# EasyEDA schematic 1-Schematic_SmartTracker.json
TITLE: SmartTracker; REV: 1.0; Date: 2023-10-11; Sheet: 1/1; Drawn By: eleminer; Company: SmartTracker
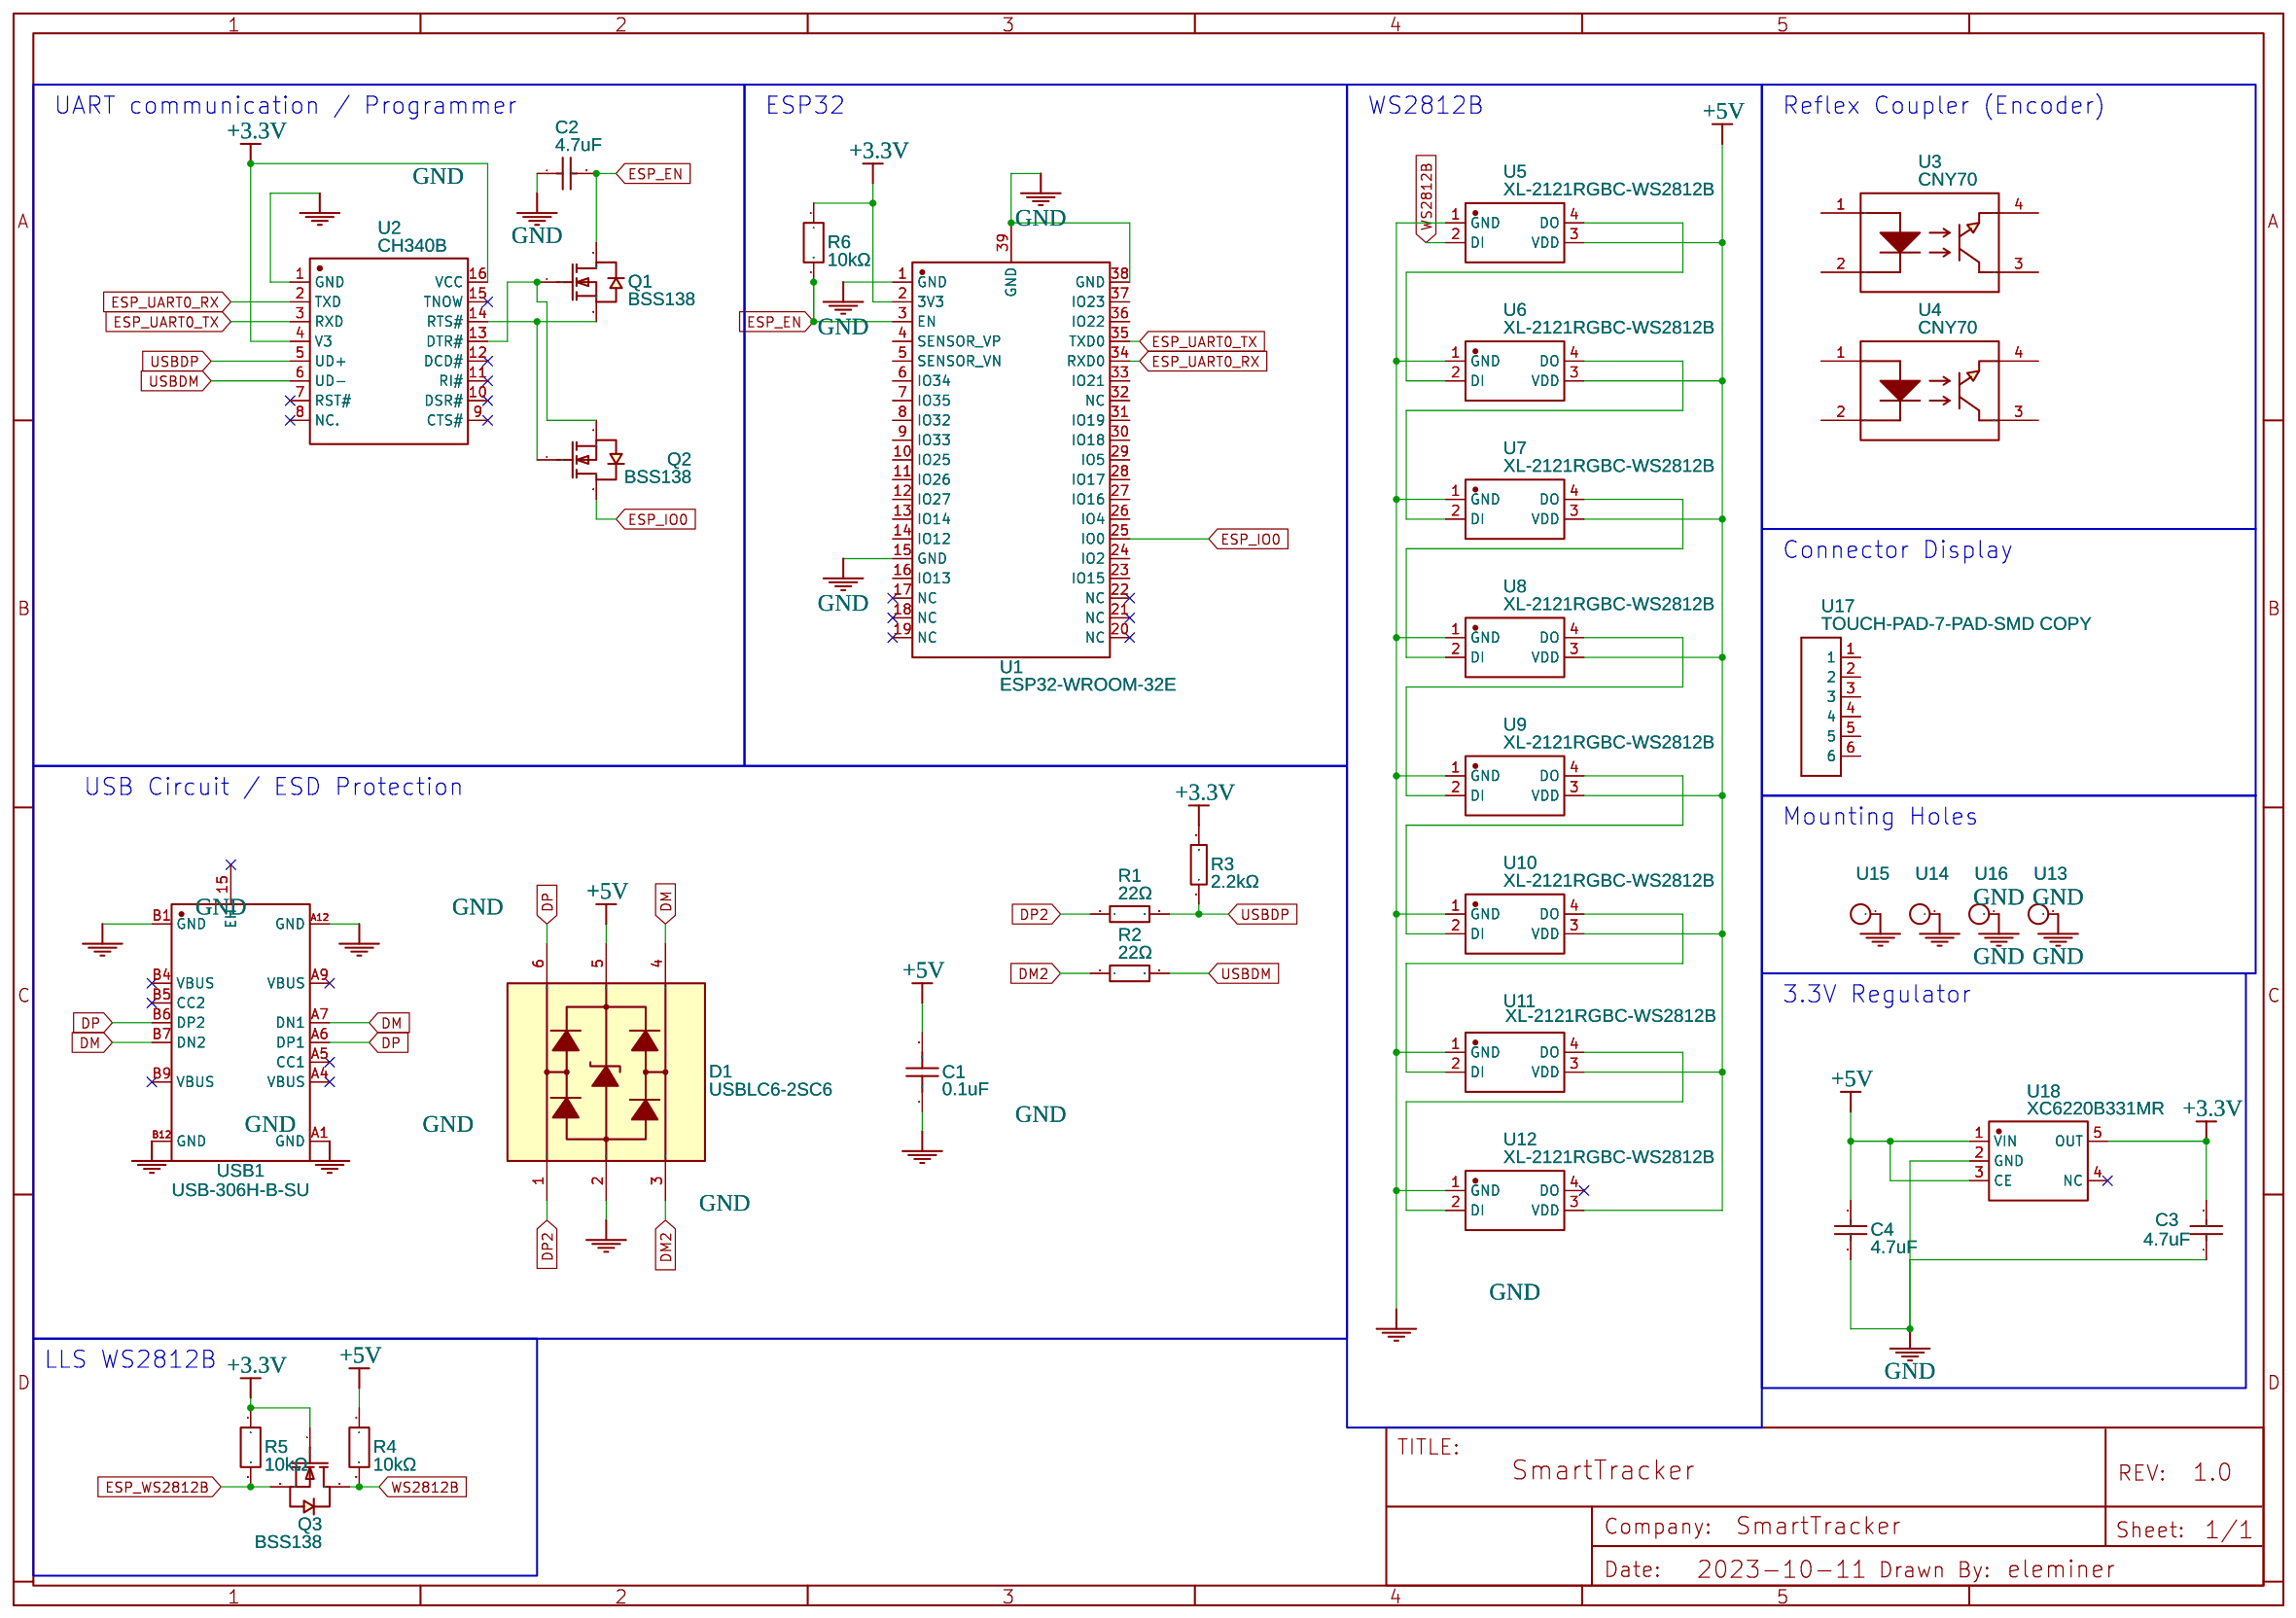
[diagram p0: schematic sheet]

## Parts
C1  0.1uF  [C0603]
C2  4.7uF  [C0402]
C3  4.7uF  [C0402]
C4  4.7uF  [C0402]
D1  USBLC6-2SC6  [SOT-23-6_L2.9-W1.6-P0.95-LS2.8-BL]
Q1  BSS138  [SOT-23-3_L2.9-W1.3-P1.90-LS2.4-BR]
Q2  BSS138  [SOT-23-3_L2.9-W1.3-P1.90-LS2.4-BR]
Q3  BSS138  [SOT-23-3_L2.9-W1.3-P1.90-LS2.4-BR]
R1  22Ω  [R0402]
R2  22Ω  [R0402]
R3  2.2kΩ  [R0402]
R4  10kΩ  [R0805]
R5  10kΩ  [R0805]
R6  10kΩ  [R0805]
U1  ESP32-WROOM-32E  [WIFI-SMD_ESP32-WROOM-32E]
U2  CH340B  [SOIC-16_L9.9-W3.9-P1.27-LS6.0-BL]
U3  CNY70  [OPTO-TH_CNY70]
U4  CNY70  [OPTO-TH_CNY70]
U5  XL-2121RGBC-WS2812B  [LED-SMD_4P-L2.1-W2.1-BL]
U6  XL-2121RGBC-WS2812B  [LED-SMD_4P-L2.1-W2.1-BL]
U7  XL-2121RGBC-WS2812B  [LED-SMD_4P-L2.1-W2.1-BL]
U8  XL-2121RGBC-WS2812B  [LED-SMD_4P-L2.1-W2.1-BL]
U9  XL-2121RGBC-WS2812B  [LED-SMD_4P-L2.1-W2.1-BL]
U10  XL-2121RGBC-WS2812B  [LED-SMD_4P-L2.1-W2.1-BL]
U11  XL-2121RGBC-WS2812B  [LED-SMD_4P-L2.1-W2.1-BL]
U12  XL-2121RGBC-WS2812B  [LED-SMD_4P-L2.1-W2.1-BL]
U13  NO  [HOLE_D3M5_D7M0_PAD_PTH]
U14  NO  [HOLE_D3M5_D7M0_PAD_PTH]
U15  NO  [HOLE_D3M5_D7M0_PAD_PTH]
U16  NO  [HOLE_D3M5_D7M0_PAD_PTH]
U17  TOUCH-PAD-7-PAD-SMD COPY  [TOUCH-PAD-6-PAD-SMD-FOOTPRINT]
U18  XC6220B331MR  [SOT-23-5_L2.9-W1.6-P0.95-LS2.8-BR]
USB1  USB-306H-B-SU  [USB-TYPE-C-TH_USB-306H-B-SU]

## Library data of the parts
C1 = 0603BB104K500NGT: Contributor: LCSC; Supplier: LCSC; Supplier Part: C2168571; Manufacturer: Knowles(楼氏); JLCPCB Part Class: Extended Part; link: https://lcsc.com/eda_search?q=C2168571&%26type=1&ref=editor
C2-C4 = CL05A475MP5NRNC: Supplier: LCSC; Manufacturer: SAMSUNG(三星); Supplier Part: C23733; JLCPCB Part Class: Basic Part; link: https://lcsc.com/eda_search?q=C23733&%26type=1&ref=editor
D1 = USBLC6-2SC6: Supplier: LCSC; Manufacturer: ST(意法半导体); Supplier Part: C7519; JLCPCB Part Class: Extended Part; link: https://lcsc.com/eda_search?q=C7519&%26type=1&ref=editor
Q1-Q3 = BSS138: Supplier: LCSC; Manufacturer: CJ(江苏长电/长晶); Supplier Part: C78284; JLCPCB Part Class: Extended Part; link: https://lcsc.com/eda_search?q=C78284&%26type=1&ref=editor
R1 R2 = 0402WGF220JTCE: Supplier: LCSC; Manufacturer: UNI-ROYAL(厚声); Supplier Part: C25092; JLCPCB Part Class: Basic Part; link: https://lcsc.com/eda_search?q=C25092&%26type=1&ref=editor
R3 = 0402WGF2201TCE: Supplier: LCSC; Manufacturer: UNI-ROYAL(厚声); Supplier Part: C25879; JLCPCB Part Class: Basic Part; link: https://lcsc.com/eda_search?q=C25879&%26type=1&ref=editor
R4-R6 = CR-05FA7---10K: Contributor: LCSC; Supplier: LCSC; Supplier Part: C465472; Manufacturer: Viking(光颉); JLCPCB Part Class: Extended Part; link: https://lcsc.com/eda_search?q=C465472&%26type=1&ref=editor
U1 = ESP32-WROOM-32E(8MB): Contributor: LCSC; Supplier: LCSC; Supplier Part: C701342; Manufacturer: ESPRESSIF(乐鑫); Manufacturer Part: ESP32-WROOM-32E-N8; JLCPCB Part Class: Extended Part; link: https://lcsc.com/eda_search?q=C701342&%26type=1&ref=editor
U2 = CH340B: Supplier: LCSC; Manufacturer: WCH(南京沁恒); Supplier Part: C81010; JLCPCB Part Class: Extended Part; link: https://lcsc.com/eda_search?q=C81010&%26type=1&ref=editor
U3 U4 = CNY70: Contributor: LCSC; Supplier: LCSC; Supplier Part: C145423; Manufacturer: VISHAY(威世); JLCPCB Part Class: Extended Part; link: https://lcsc.com/eda_search?q=C145423&%26type=1&ref=editor
U5-U12 = XL-2121RGBC-WS2812B: Contributor: lcsc; Supplier: LCSC; Supplier Part: C5349957; Manufacturer: XINGLIGHT(成兴光); JLCPCB Part Class: Extended Part; link: https://lcsc.com/eda_search?q=C5349957&%26type=1&ref=editor
U13-U16 = M3 CLR HOLE: Contributor: andyfierman; sourceId: zBJD82WQ8
U17 = TOUCH-PAD-7-PAD-SMD COPY: 2x5 Connector (Cortex Debug Connector); Contributor: mildwinters2020
U18 = XC6220B331MR: Contributor: lcsc; Supplier: LCSC; Supplier Part: C3040644; Manufacturer: TECH PUBLIC(台舟); JLCPCB Part Class: Extended Part; link: https://lcsc.com/eda_search?q=C3040644&%26type=1&ref=editor
USB1 = USB-306H-B-SU: Contributor: LCSC; Supplier: LCSC; Supplier Part: C309344; Manufacturer: HOOYA; JLCPCB Part Class: Extended Part; link: https://lcsc.com/eda_search?q=C309344&%26type=1&ref=editor; Package Display: No

## Nets
+3.3V: C3.2 Q3.1(G) R3.2 R5.1 R6.1 U1.2(3V3) U2.4(V3) U2.16(VCC) U18.5(OUT)
+5V: C1.2 C4.1 D1.5 R4.1 U5.3(VDD) U6.3(VDD) U7.3(VDD) U8.3(VDD) U9.3(VDD) U10.3(VDD) U11.3(VDD) U12.3(VDD) U18.1(VIN) U18.3(CE)
GND: C1.1 C2.1 C3.1 C4.2 D1.2 U1.1(GND) U1.15(GND) U1.38(GND) U1.39(GND) U2.1(GND) U5.1(GND) U6.1(GND) U7.1(GND) U8.1(GND) U9.1(GND) U10.1(GND) U11.1(GND) U12.1(GND) U13.1 U14.1 U15.1 U16.1 U18.2(GND) USB1.A1(GND) USB1.A12(GND) USB1.B1(GND) USB1.B12(GND)
DM: D1.4 USB1.A7(DN1) USB1.B7(DN2)
DM2: D1.3 R2.1
DP: D1.6 USB1.A6(DP1) USB1.B6(DP2)
DP2: D1.1 R1.1
ESP_EN: C2.2 Q1.3(D) R6.2 U1.3(EN)
ESP_IO0: Q2.3(D) U1.25(IO0)
ESP_UART0_RX: U1.34(RXD0) U2.2(TXD)
ESP_UART0_TX: U1.35(TXD0) U2.3(RXD)
ESP_WS2812B: Q3.2(S) R5.2
USBDM: R2.2 U2.6(UD-)
USBDP: R1.2 R3.1 U2.5(UD+)
WS2812B: Q3.3(D) R4.2 U5.2(DI)
Net-(Q1-1): Q1.1(G) Q2.2(S) U2.13(DTR#)
Net-(Q1-2): Q1.2(S) Q2.1(G) U2.14(RTS#)
Net-(U5-4): U5.4(DO) U6.2(DI)
Net-(U6-4): U6.4(DO) U7.2(DI)
Net-(U7-4): U7.4(DO) U8.2(DI)
Net-(U8-4): U8.4(DO) U9.2(DI)
Net-(U9-4): U9.4(DO) U10.2(DI)
Net-(U10-4): U10.4(DO) U11.2(DI)
Net-(U11-4): U11.4(DO) U12.2(DI)

Not connected (* = marked no-connect by the designer): U1 4(SENSOR_VP) 5(SENSOR_VN) 6(IO34) 7(IO35) 8(IO32) 9(IO33) 10(IO25) 11(IO26) 12(IO27) 13(IO14) 14(IO12) 16(IO13) 17(NC)* 18(NC)* 19(NC)* 20(NC)* 21(NC)* 22(NC)* 23(IO15) 24(IO2) 26(IO4) 27(IO16) 28(IO17) 29(IO5) 30(IO18) 31(IO19) 32(NC) 33(IO21) 36(IO22) 37(IO23); U2 7(RST#)* 8(NC.)* 9(CTS#)* 10(DSR#)* 11(RI#)* 12(DCD#)* 15(TNOW)*; U3 1 2 3 4; U4 1 2 3 4; U12 4(DO)*; U17 1 2 3 4 5 6; U18 4(NC)*; USB1 15(EH)* A4(VBUS)* A5(CC1)* A9(VBUS)* B4(VBUS)* B5(CC2)* B9(VBUS)*

## Notes on the sheet
- UART communication / Programmer
- ESP32
- WS2812B
- Reflex Coupler (Encoder)
- Connector Display
- USB Circuit / ESD Protection
- Mounting Holes
- 3.3V Regulator
- LLS WS2812B
